# EAGLE schematic Shruthi-DSP-v01 (EAGLE 5.09)
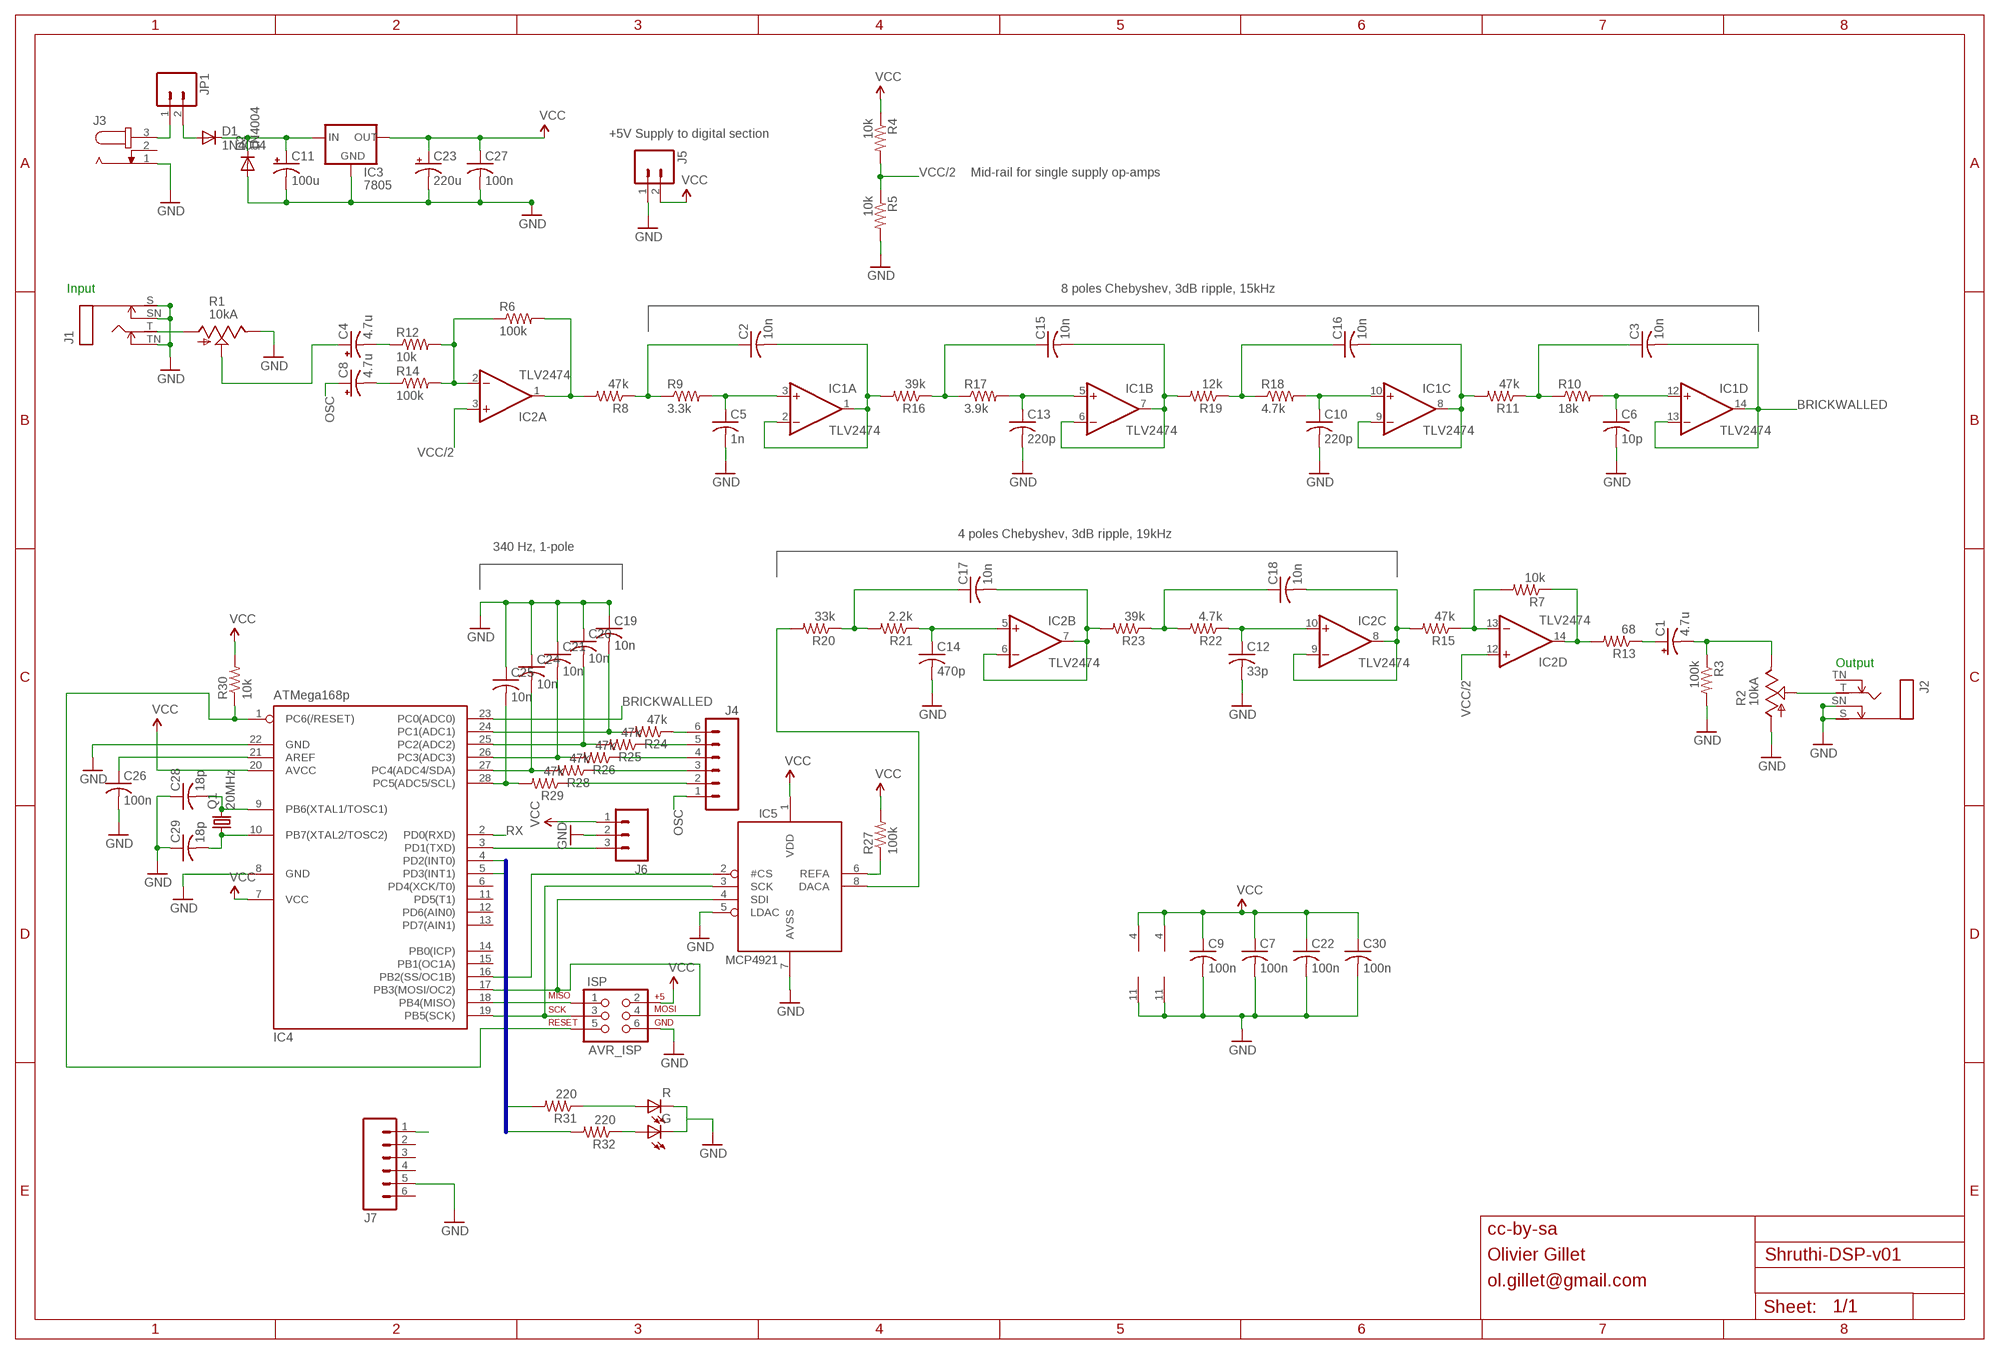
[diagram p0: schematic, sheet 1]

## Parts
C1  4.7u  CPOL-USE2.5-6  [E2,5-6]
C2  10n  C-US050-025X075  [C050-025X075]
C3  10n  C-US050-025X075  [C050-025X075]
C4  4.7u  CPOL-USE2.5-6  [E2,5-6]
C5  1n  C-US025-025X050  [C025-025X050]
C6  10p  C-US025-025X050  [C025-025X050]
C7  100n  C-US025-025X050  [C025-025X050]
C8  4.7u  CPOL-USE2.5-6  [E2,5-6]
C9  100n  C-US025-025X050  [C025-025X050]
C10  220p  C-US025-025X050  [C025-025X050]
C11  100u  CPOL-USE2.5-7  [E2,5-7]
C12  33p  C-US025-025X050  [C025-025X050]
C13  220p  C-US025-025X050  [C025-025X050]
C14  470p  C-US025-025X050  [C025-025X050]
C15  10n  C-US050-025X075  [C050-025X075]
C16  10n  C-US050-025X075  [C050-025X075]
C17  10n  C-US050-025X075  [C050-025X075]
C18  10n  C-US050-025X075  [C050-025X075]
C19  10n  C-US050-025X075  [C050-025X075]
C20  10n  C-US050-025X075  [C050-025X075]
C21  10n  C-US050-025X075  [C050-025X075]
C22  100n  C-US025-025X050  [C025-025X050]
C23  220u  CPOL-USE5-10.5  [E5-10,5]
C24  10n  C-US050-025X075  [C050-025X075]
C25  10n  C-US050-025X075  [C050-025X075]
C26  100n  C-US025-025X050  [C025-025X050]
C27  100n  C-US025-025X050  [C025-025X050]
C28  18p  C-US025-024X044  [C025-024X044]
C29  18p  C-US025-024X044  [C025-024X044]
C30  100n  C-US025-024X044  [C025-024X044]
D1  1N4004  [DO41-10]
D2  1N4004  [DO41-10]
G  LED3MM  [LED3MM]
IC1  TLV2474  TL084P  [DIL14]
IC2  TLV2474  TL084P  [DIL14]
IC3  7805  78XXS  [78XXS]
IC4  ATMega168p  MEGA8-P  [DIL28-3]
IC5  MCP4921  [DIL08]
ISP  AVR_ISP  AVR_SPI_PRG_6PTH  [2X3]
J1  MONOSWS  [NMJ4HC-S]
J2  MONOSWS  [NMJ4HC-S]
J3  JACK-PLUG  [SPC4078_LARGER_HOLES]
J4  M06SIP  [1X06]
J5  M02PTH  [1X02]
J6  M03PTH  [1X03]
J7  M06SIP  [1X06]
JP1  M02  [1X02_LONGPADS]
Q1  20MHz  CRYSTALHC49U-V  [HC49U-V]
R  LED3MM  [LED3MM]
R1  10kA  POT_USCABLED  [CABLE_POT_6MM]
R2  10kA  POT_USCABLED  [CABLE_POT_6MM]
R3  100k  R-US_0204/7  [0204/7]
R4  10k  R-US_0204/7  [0204/7]
R5  10k  R-US_0204/7  [0204/7]
R6  100k  R-US_0204/7  [0204/7]
R7  10k  R-US_0204/7  [0204/7]
R8  47k  R-US_0204/7  [0204/7]
R9  3.3k  R-US_0204/7  [0204/7]
R10  18k  R-US_0204/7  [0204/7]
R11  47k  R-US_0204/7  [0204/7]
R12  10k  R-US_0204/7  [0204/7]
R13  68  R-US_0204/7  [0204/7]
R14  100k  R-US_0204/7  [0204/7]
R15  47k  R-US_0204/7  [0204/7]
R16  39k  R-US_0204/7  [0204/7]
R17  3.9k  R-US_0204/7  [0204/7]
R18  4.7k  R-US_0204/7  [0204/7]
R19  12k  R-US_0204/7  [0204/7]
R20  33k  R-US_0204/7  [0204/7]
R21  2.2k  R-US_0204/7  [0204/7]
R22  4.7k  R-US_0204/7  [0204/7]
R23  39k  R-US_0204/7  [0204/7]
R24  47k  R-US_0204/7  [0204/7]
R25  47k  R-US_0204/7  [0204/7]
R26  47k  R-US_0204/7  [0204/7]
R27  100k  R-US_0204/7  [0204/7]
R28  47k  R-US_0204/7  [0204/7]
R29  47k  R-US_0204/7  [0204/7]
R30  10k  R-US_0204/7  [0204/7]
R31  220  R-US_0204/7  [0204/7]
R32  220  R-US_0204/7  [0204/7]

## Nets
BRICKWALLED: C3.2 IC1.13(D:-IN) IC1.14(D:OUT) IC4.23(PC0(ADC0))
GND: C5.2 C6.2 C7.2 C9.2 C10.2 C11.- C12.2 C13.2 C14.2 C19.1 C20.1 C21.1 C22.2 C23.- C24.1 C25.1 C26.2 C27.2 C28.1 C29.1 C30.2 D2.A G.K(C) IC1.11(P:V-) IC2.11(P:V-) IC3.GND IC4.8(GND) IC4.22(GND) IC5.5(LDAC) IC5.7(AVSS) ISP.6 J1.S J1.SN J1.TN J2.S J2.SN J3.1 J5.1 J6.2 J7.5 R1.E R2.A R3.2 R5.2 R.K(C)
LEDS0: IC4.4(PD2(INT0)) R31.2
LEDS1: IC4.5(PD3(INT1)) R32.2
N$1: C5.1 IC1.3(A:+IN) R9.2
N$2: C2.1 R8.1 R9.1
N$3: J3.3 JP1.1
N$4: C11.+ D1.C D2.C IC3.IN
N$5: C2.2 IC1.1(A:OUT) IC1.2(A:-IN) R16.2
N$6: C13.1 IC1.5(B:+IN) R17.2
N$7: C15.1 R16.1 R17.1
N$8: C15.2 IC1.6(B:-IN) IC1.7(B:OUT) R19.2
N$9: C10.1 IC1.10(C:+IN) R18.2
N$10: C16.1 R18.1 R19.1
N$11: C16.2 IC1.8(C:OUT) IC1.9(C:-IN) R11.2
N$12: C6.1 IC1.12(D:+IN) R10.2
N$13: C3.1 R10.1 R11.1
N$14: IC4.1(PC6(/RESET)) ISP.5 R30.1
N$16: C26.1 IC4.21(AREF)
N$18: IC4.18(PB4(MISO)) ISP.1
N$19: IC4.19(PB5(SCK)) IC5.3(SCK) ISP.3
N$20: IC5.6(REFA) R27.1
N$21: C4.+ R1.S
N$22: IC4.17(PB3(MOSI/OC2)) IC5.4(SDI) ISP.4
N$23: J1.T R1.A
N$24: IC4.16(PB2(SS/OC1B)) IC5.2(#CS)
N$25: C17.1 R20.1 R21.2
N$26: C4.- R12.1
N$27: C14.1 IC2.5(B:+IN) R21.1
N$28: C17.2 IC2.6(B:-IN) IC2.7(B:OUT) R23.2
N$29: J4.2 R29.1
N$30: C18.1 R22.2 R23.1
N$31: C12.1 IC2.10(C:+IN) R22.1
N$32: C18.2 IC2.8(C:OUT) IC2.9(C:-IN) R15.2
N$33: IC5.8(DACA) R20.2
N$34: C1.- R2.E R3.1
N$35: C8.- R14.1
N$36: IC2.13(D:-IN) R7.2 R15.1
N$37: IC2.14(D:OUT) R7.1 R13.2
N$38: C1.+ R13.1
N$39: IC4.3(PD1(TXD)) J6.3
N$40: IC2.2(A:-IN) R6.1 R12.2 R14.2
N$41: J2.T R2.S
N$42: IC2.1(A:OUT) R6.2 R8.2
N$43: J4.3 R28.1
N$44: J4.4 R26.1
N$45: J4.5 R25.1
N$46: J4.6 R24.1
N$47: C25.2 IC4.28(PC5(ADC5/SCL)) R29.2
N$48: C24.2 IC4.27(PC4(ADC4/SDA)) R28.2
N$49: C21.2 IC4.26(PC3(ADC3)) R26.2
N$50: C20.2 IC4.25(PC2(ADC2)) R25.2
N$51: C19.2 IC4.24(PC1(ADC1)) R24.2
N$55: R31.1 R.A
N$56: G.A R32.1
N$59: D1.A JP1.2
N$82: C29.2 IC4.10(PB7(XTAL2/TOSC2)) Q1.1
N$83: C28.2 IC4.9(PB6(XTAL1/TOSC1)) Q1.2
OSC: C8.+ J4.1
RX: IC4.2(PD0(RXD)) J7.1
VCC: C7.1 C9.1 C22.1 C23.+ C27.1 C30.1 IC1.4(P:V+) IC2.4(P:V+) IC3.OUT IC4.7(VCC) IC4.20(AVCC) IC5.1(VDD) ISP.2 J5.2 J6.1 R4.1 R27.2 R30.2
VCC/2: IC2.3(A:+IN) IC2.12(D:+IN) R4.2 R5.1
Unconnected: IC4.6(PD4(XCK/T0)) IC4.11(PD5(T1)) IC4.12(PD6(AIN0)) IC4.13(PD7(AIN1)) IC4.14(PB0(ICP)) IC4.15(PB1(OC1A)) J2.TN J3.2 J7.2 J7.3 J7.4 J7.6

## Buses
LEDS[0..1]

## Notes on the sheet
- +5V Supply to digital section
- Mid-rail for single supply op-amps
- Input | 8 poles Chebyshev, 3dB ripple, 15kHz
- 4 poles Chebyshev, 3dB ripple, 19kHz
- 340 Hz, 1-pole
- Output
- cc-by-sa
- Olivier Gillet
- ol.gillet@gmail.com

## Library data of the parts
C1 C4 C8 C11 C23 = rcl:CPOL-US: POLARIZED CAPACITOR, American symbol
C2 C3 C5-C7 C9 C10 C12-C22 C24-C30 = rcl:C-US: CAPACITOR, American symbol
D1 D2 = diode:1N4004: DIODE general purpose rectifier, 1 A
G R = led:LED: LED OSRAM: - CHIPLED LG R971, LG N971, LY N971, LG Q971, LY Q971, LO R971, LY R971 LH N974, LH R974 LS Q976, LO Q976, LY Q976 LO Q996 - Hyper CHIPLED LW Q18S LB Q993, LB Q99A, LB R99A - SideLED LS A670, LO A670, LY A670, LG A670, LP A670 LB A673, LV A673, LT A673, LW A673 LH A674 LY A675 LS A676, LA A676, LO A676, LY A676, LW A676 LS A679, LY A679, LG A679 - Hyper Micro SIDELED® LS Y876, LA Y876, LO Y876, LY Y876 LT Y87S - SmartLED LW L88C, LW L88S LB L89C, LB L89S, LG L890 LS L89K, LO L89K, LY L89K LS L896, LA L896, LO L896, LY L896 - TOPLED LS T670, LO T670, LY T670, LG T670, LP T670 LSG T670, LSP T670, LSY T670, LOP T670, LYG T670 LG T671, LOG T671, LSG T671 LB T673, LV T673, LT T673, LW T673 LH T674 LS T676, LA T676, LO T676, LY T676, LB T676, LH T676, LSB T676, LW T676 LB T67C, LV T67C, LT T67C, LS T67K, LO T67K, LY T67K, LW E67C LS E67B, LA E67B, LO E67B, LY E67B, LB E67C, LV E67C, LT E67C LW T67C LS T679, LY T679, LG T679 LS T770, LO T770, LY T770, LG T770, LP T770 LB T773, LV T773, LT T773, LW T773 LH T774 LS E675, LA E675, LY E675, LS T675 LS T776, LA T776, LO T776, LY T776, LB T776 LHGB T686 LT T68C, LB T68C - Hyper Mini TOPLED® LB M676 - Mini TOPLED Santana® LG M470 LS M47K, LO M47K, LY M47K Source: http://www.osram.convergy.de LUXEON: - LUMILED® LXK2-PW12-R00, LXK2-PW12-S00, LXK2-PW14-U00, LXK2-PW14-V00 LXK2-PM12-R00, LXK2-PM12-S00, LXK2-PM14-U00 LXK2-PE12-Q00, LXK2-PE12-R00, LXK2-PE12-S00, LXK2-PE14-T00, LXK2-PE14-U00 LXK2-PB12-K00, LXK2-PB12-L00, LXK2-PB12-M00, LXK2-PB14-N00, LXK2-PB14-P00, LXK2-PB14-Q00 LXK2-PR12-L00, LXK2-PR12-M00, LXK2-PR14-Q00, LXK2-PR14-R00 LXK2-PD12-Q00, LXK2-PD12-R00, LXK2-PD12-S00 LXK2-PH12-R00, LXK2-PH12-S00 LXK2-PL12-P00, LXK2-PL12-Q00, LXK2-PL12-R00 Source: www.luxeon.com KINGBRIGHT: KA-3528ASYC Source: www.kingbright.com
IC1 IC2 = linear:TL084: OP AMP
IC3 = v-reg:78XXS: VOLTAGE REGULATOR
IC4 = atmel:MEGA8-P: MICROCONTROLLER 8 Kbytes FLASH, 1 kbytes SRAM, 512 bytes EEPROM, USART, 4-channel 10 bit ADC, 2-channel 8 bit ADC Pin compatible with Atmega48, ATMega88, ATMega168 Source: avr.lbr
IC5 = adafruit:MCP4921
ISP = SparkFun:AVR_SPI_PRG_6: AVR ISP 6 Pin This is the reduced ISP connector for AVR programming. Common on Arduino. This footprint will take up less PCB space and can be used with a 10-pin to 6-pin adapter such as SKU: BOB-08508
J1 J2 = gm-jacks:MONOSW
J3 = con-jack2:JACK-PLUG: DC POWER JACK Power Jack, DC, Right Angle, Through Hole, Rated 5A at 16VDC, PC Terminals Distributor: Farnell (www.Farnell.de) Drawing: 84N1161.pdf / 84N1162.pdf Manufacturer: SPC Technology (www.spctechnology.com) Type: SPC4077 / SPC 4078
J4 J7 = SparkFun:M06: Header 6 Standard 6-pin 0.1" header. Use with straight break away headers (SKU : PRT-00116), right angle break away headers (PRT-00553), swiss pins (PRT-00743), machine pins (PRT-00117), and female headers (PRT-00115). Molex polarized connector foot print use with SKU : PRT-08094 with associated crimp pins and housings. NOTES ON THE VARIANTS LOCK and LOCK_LONGPADS... This footprint was designed to help hold the alignment of a through-hole component (i.e. 6-pin header) while soldering it into place. You may notice that each hole has been shifted either up or down by 0.005 of an inch from it's more standard position (which is a perfectly straight line). This slight alteration caused the pins (the squares in the middle) to touch the edges of the holes. Because they are alternating, it causes a "brace" to hold the component in place. 0.005 has proven to be the perfect amount of "off-center" position when using our standard breakaway headers. Although looks a little odd when you look at the bare footprint, once you have a header in there, the alteration is very hard to notice. Also, if you push a header all the way into place, it is covered up entirely on the bottom side. This idea of altering the position of holes to aid alignment will be further integrated into the Sparkfun Library for other footprints. It can help hold any component with 3 or more connection pins.
J5 JP1 = SparkFun:M02: Header 2 Standard 2-pin 0.1" header. Use with straight break away headers (SKU : PRT-00116), right angle break away headers (PRT-00553), swiss pins (PRT-00743), machine pins (PRT-00117), and female headers (PRT-00115). Molex polarized connector foot print use with SKU : PRT-08233 with associated crimp pins and housings.
J6 = SparkFun:M03: Header 3 Standard 3-pin 0.1" header. Use with straight break away headers (SKU : PRT-00116), right angle break away headers (PRT-00553), swiss pins (PRT-00743), machine pins (PRT-00117), and female headers (PRT-00115). Molex polarized connector foot print use with SKU : PRT-08232 with associated crimp pins and housings.
Q1 = crystal:CRYSTAL: CRYSTAL
R1 R2 = pot-cable:POT_US
R3-R32 = rcl:R-US_: RESISTOR, American symbol